# Altium project H-Bridge-SingleV2.2.PrjPCB
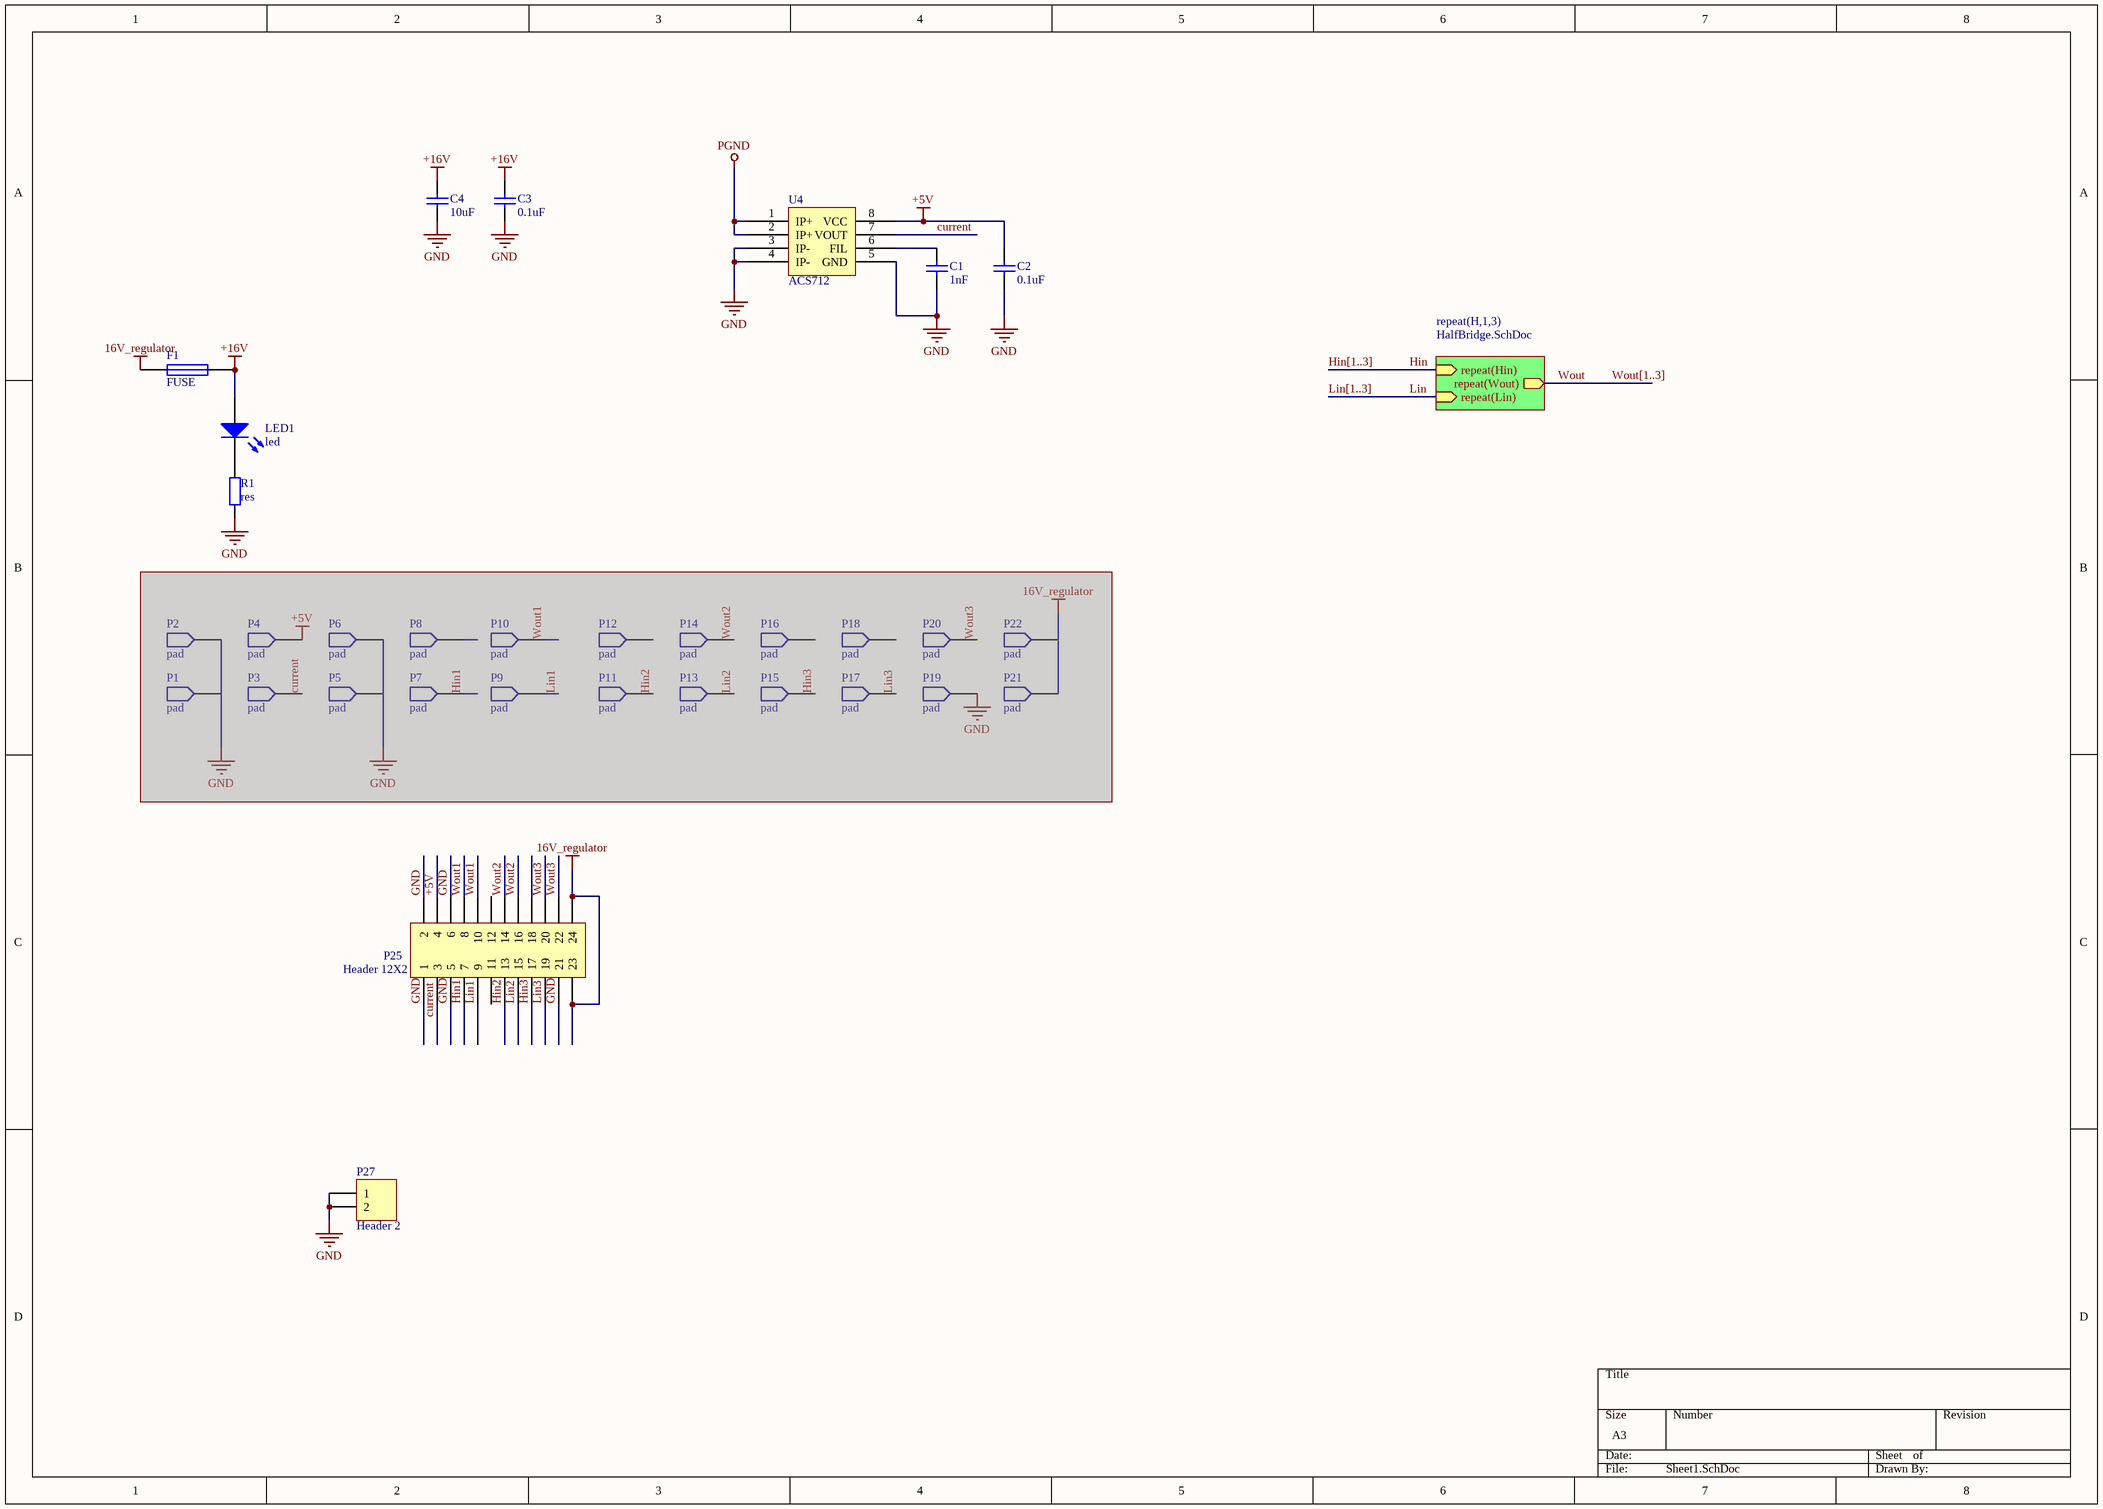
[diagram p0: Sheet1.SchDoc]
2 sheets, 59 parts. Net scope: hierarchical (ports join the sheet entries above them; power ports are global).
Board files: HBridge_V2.2.PcbDoc, HBridge_V2.3.PcbDoc
Sheets:
  Sheet1.SchDoc
    H1 = HalfBridge.SchDoc
    H2 = HalfBridge.SchDoc
    H3 = HalfBridge.SchDoc

## Sheet Sheet1.SchDoc
size A3

### Parts
C1  1nF  [0603]
C2  0.1uF  [0603]
C3  0.1uF  [0603]
C4  10uF  [0603]
F1  FUSE  [FUSE]
LED1  led  [0603_diode]
P1  pad  [pad-blank]  (masked out: inside a compile mask, not in the netlist)
P2  pad  [pad-blank]  (masked out: inside a compile mask, not in the netlist)
P3  pad  [pad-blank]  (masked out: inside a compile mask, not in the netlist)
P4  pad  [pad-blank]  (masked out: inside a compile mask, not in the netlist)
P5  pad  [pad-blank]  (masked out: inside a compile mask, not in the netlist)
P6  pad  [pad-blank]  (masked out: inside a compile mask, not in the netlist)
P7  pad  [pad-blank]  (masked out: inside a compile mask, not in the netlist)
P8  pad  [pad-blank]  (masked out: inside a compile mask, not in the netlist)
P9  pad  [pad-blank]  (masked out: inside a compile mask, not in the netlist)
P10  pad  [pad-blank]  (masked out: inside a compile mask, not in the netlist)
P11  pad  [pad-blank]  (masked out: inside a compile mask, not in the netlist)
P12  pad  [pad-blank]  (masked out: inside a compile mask, not in the netlist)
P13  pad  [pad-blank]  (masked out: inside a compile mask, not in the netlist)
P14  pad  [pad-blank]  (masked out: inside a compile mask, not in the netlist)
P15  pad  [pad-blank]  (masked out: inside a compile mask, not in the netlist)
P16  pad  [pad-blank]  (masked out: inside a compile mask, not in the netlist)
P17  pad  [pad-blank]  (masked out: inside a compile mask, not in the netlist)
P18  pad  [pad-blank]  (masked out: inside a compile mask, not in the netlist)
P19  pad  [pad-blank]  (masked out: inside a compile mask, not in the netlist)
P20  pad  [pad-blank]  (masked out: inside a compile mask, not in the netlist)
P21  pad  [pad-blank]  (masked out: inside a compile mask, not in the netlist)
P22  pad  [pad-blank]  (masked out: inside a compile mask, not in the netlist)
P25  Header 12X2  [HDR2X12]
P27  Header 2  [HDR1X2]
R1  res  [0603]
U4  ACS712  [SOIC-8]

### Sub-sheets
repeat(H,1,3) = HalfBridge.SchDoc: repeat(Wout) (out), repeat(Hin) (in), repeat(Lin) (in)

### Nets
16V_regulator: F1.1 P25.23 P25.24
+5V: C2.2 P25.4 U4.8(VCC)
+16V: C3.2 C4.2 F1.2 LED1.1(A)
GND: C1.1 C2.1 C3.1 C4.1 P25.1 P25.2 P25.5 P25.6 P25.21 P27.1 P27.2 R1.1 U4.3(IP-) U4.4(IP-) U4.5(GND)
PGND: U4.1(IP+) U4.2(IP+)
current: P25.3 U4.7(VOUT)
Hin: sheet repeat(H,1,3)/repeat(Hin)
Hin1: P25.7
Hin2: P25.13
Hin3: P25.17
Lin: sheet repeat(H,1,3)/repeat(Lin)
Lin1: P25.9
Lin2: P25.15
Lin3: P25.19
Wout: sheet repeat(H,1,3)/repeat(Wout)
Wout1: P25.8 P25.10
Wout2: P25.14 P25.16
Wout3: P25.20 P25.22
NetC1_2: C1.2 U4.6(FIL)
NetLED1_2: LED1.2(K) R1.2

Not connected (* = marked no-connect by the designer): P25 11 12 18

### Buses and harness runs
bus Hin[1..3]
bus Lin[1..3]
bus Wout[1..3]

### Library data of the parts
C1-C4 = cap
P25 = Header 12X2: Header, 12-Pin, Dual row; LatestRevisionDate: 17-Jul-2002; LatestRevisionNote: Re-released for DXP Platform.; Publisher: Altium Limited
P27 = Header 2: Header, 2-Pin; LatestRevisionDate: 17-Jul-2002; LatestRevisionNote: Re-released for DXP Platform.; Publisher: Altium Limited

## Sheet HalfBridge.SchDoc
size A4
Used 3 times, as channels H1, H2, H3. Parts and nets are listed once, with the designators drawn on the sheet.
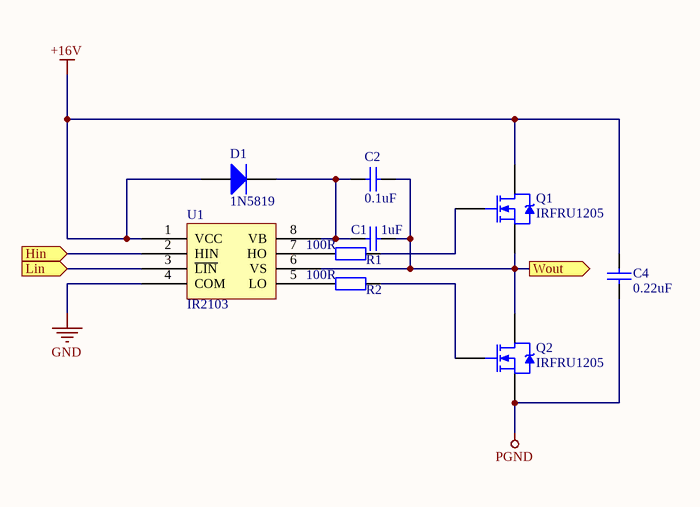
[diagram p1: HalfBridge.SchDoc]

### Parts
C1  1uF  [0603]
C2  0.1uF  [0603]
C4  0.22uF  [0603]
D1  1N5819  [SOD-123]
Q1  IRFRU1205  [TO-252]
Q2  IRFRU1205  [TO-252]
R1  100R  [0603]
R2  100R  [0603]
U1  IR2103  [SOIC-8]

### Ports
Hin (in), Lin (in), Wout (out)

### Nets
+16V: C4.2 D1.A Q1.2(D) U1.1(VCC)
GND: U1.4(COM)
PGND: C4.1 Q2.3(S)
Hin: U1.2(HIN) ; port Hin
Lin: U1.3(~{LIN}) ; port Lin
Wout: C1.2 C2.2 Q1.3(S) Q2.2(D) U1.6(VS) ; port Wout
NetC1_1: C1.1 C2.1 D1.K U1.8(VB)
NetQ1_1: Q1.1(G) R1.2
NetQ2_1: Q2.1(G) R2.2
NetR1_1: R1.1 U1.7(HO)
NetR2_1: R2.1 U1.5(LO)

### Channels
H1: designators end in _H1; ports Hin=Hin1 Lin=Lin1 Wout=Wout1
H2: designators end in _H2; ports Hin=Hin2 Lin=Lin2 Wout=Wout2
H3: designators end in _H3; ports Hin=Hin3 Lin=Lin3 Wout=Wout3

### Library data of the parts
C1 C2 C4 = cap
D1 = diode
R1 R2 = res

## Nets that join several sheets
+16V: Sheet1 (C3.2 C4.2 F1.2 LED1.1), H1 (C4_H1.2 D1_H1.A Q1_H1.2 U1_H1.1), H2 (C4_H2.2 D1_H2.A Q1_H2.2 U1_H2.1), H3 (C4_H3.2 D1_H3.A Q1_H3.2 U1_H3.1)
GND: Sheet1 (15 pins), H1 (U1_H1.4), H2 (U1_H2.4), H3 (U1_H3.4)
PGND: Sheet1 (U4.1 U4.2), H1 (C4_H1.1 Q2_H1.3), H2 (C4_H2.1 Q2_H2.3), H3 (C4_H3.1 Q2_H3.3)
Hin1: Sheet1 (P25.7), H1 (U1_H1.2)
Hin2: Sheet1 (P25.13), H2 (U1_H2.2)
Hin3: Sheet1 (P25.17), H3 (U1_H3.2)
Lin1: Sheet1 (P25.9), H1 (U1_H1.3)
Lin2: Sheet1 (P25.15), H2 (U1_H2.3)
Lin3: Sheet1 (P25.19), H3 (U1_H3.3)
Wout1: Sheet1 (P25.8 P25.10), H1 (5 pins)
Wout2: Sheet1 (P25.14 P25.16), H2 (5 pins)
Wout3: Sheet1 (P25.20 P25.22), H3 (5 pins)